# EAGLE design 18650_1S3P_Smart (EAGLE 9.6.2)
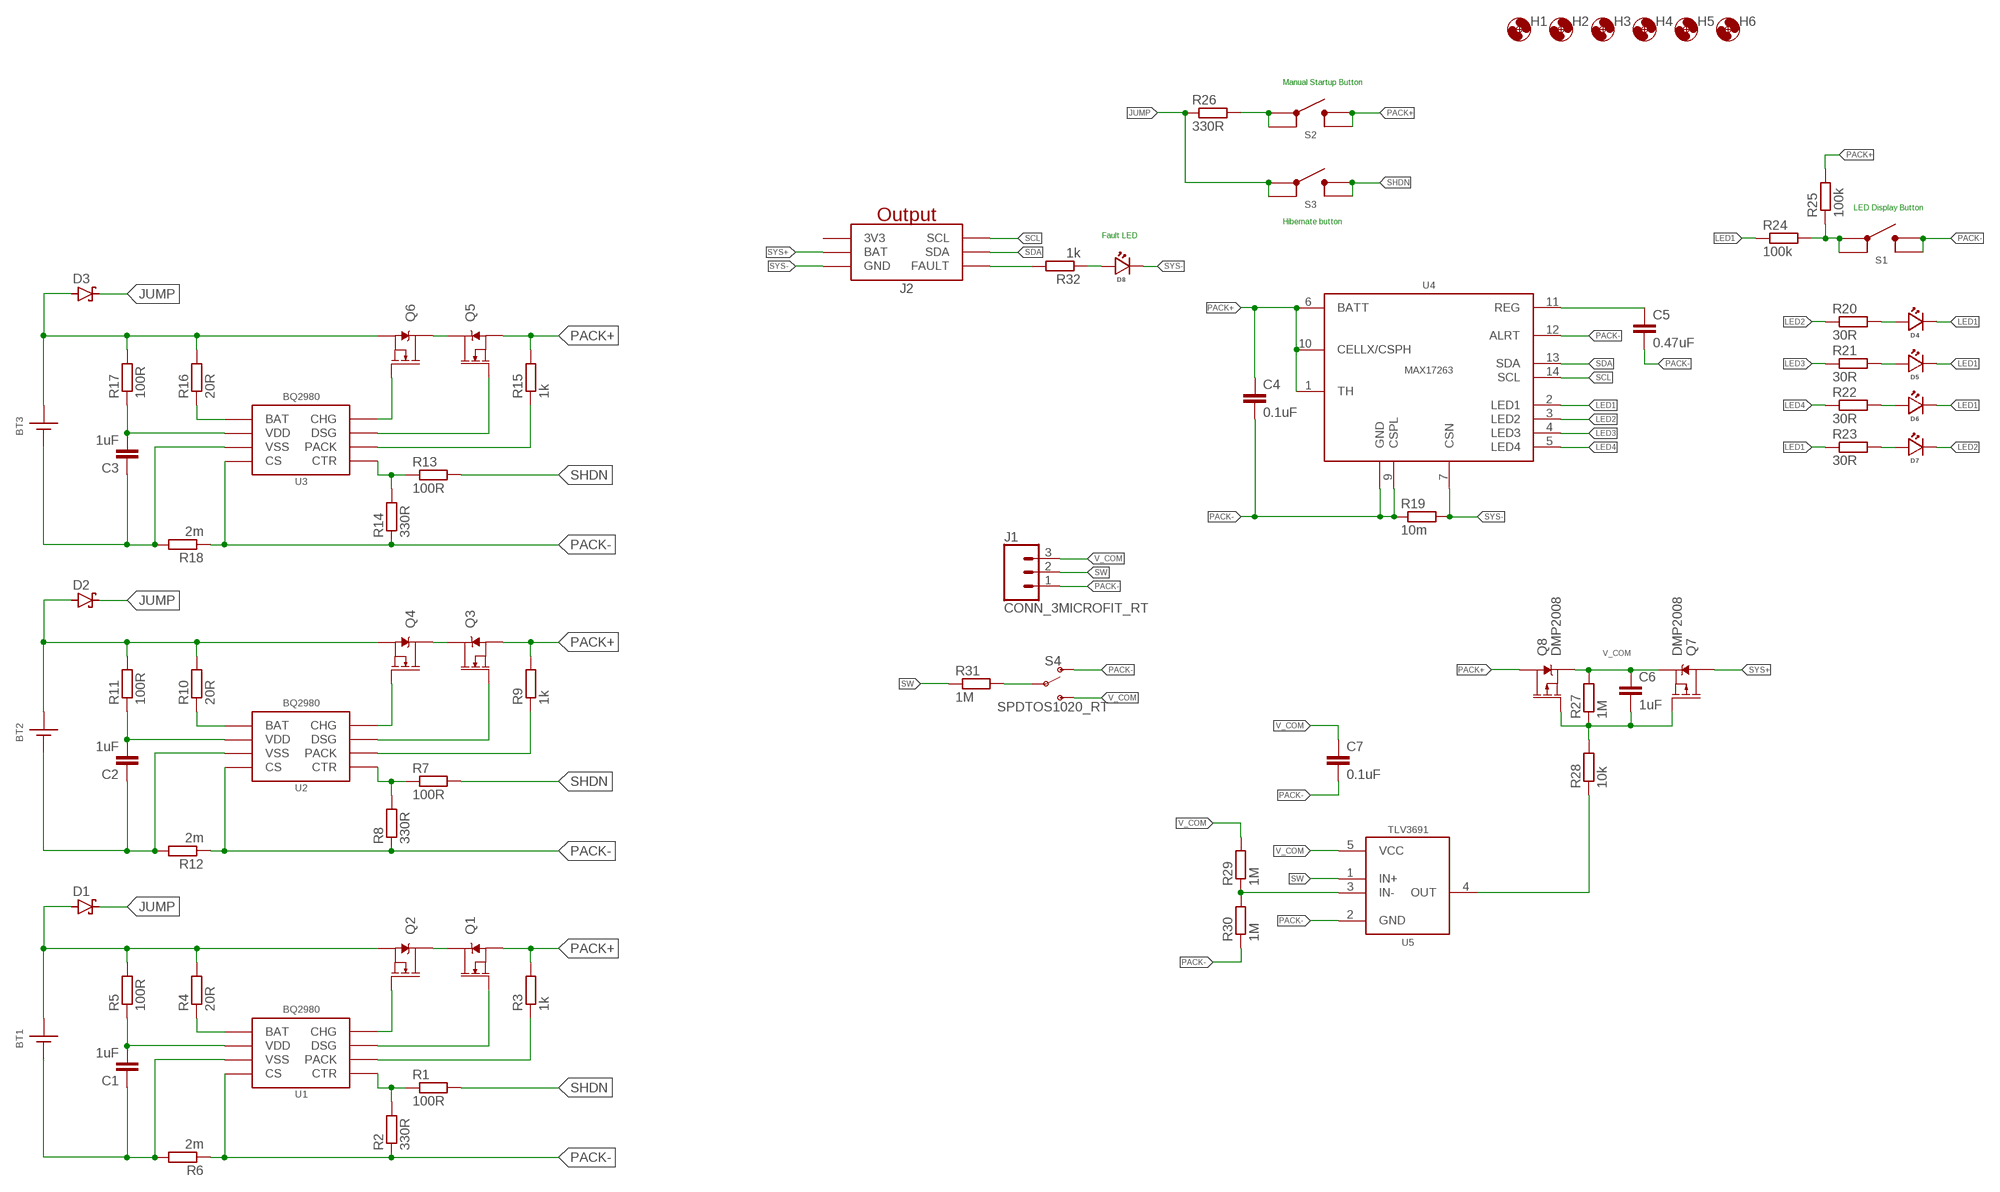
[diagram p0: schematic, sheet 1]

## Parts
BT1  186501042P_NOSILK  [BATT_1042P_NOSILK]
BT2  186501042P_NOSILK  [BATT_1042P_NOSILK]
BT3  186501042P_NOSILK  [BATT_1042P_NOSILK]
C1  1uF  C-EU1UFC0603  [C0603]
C2  1uF  C-EU1UFC0603  [C0603]
C3  1uF  C-EU1UFC0603  [C0603]
C4  0.1uF  C-EU0.1UFC0603  [C0603]
C5  0.47uF  C-EU0.47UFC0603  [C0603]
C6  1uF  C-EU1UFC0603  [C0603]
C7  0.1uF  C-EU0.1UFC0603  [C0603]
D1  DIODE_SCHOTTKYSOD-323  [SOD323-R]
D2  DIODE_SCHOTTKYSOD-323  [SOD323-R]
D3  DIODE_SCHOTTKYSOD-323  [SOD323-R]
D4  LED1206_BOTTOM  [LED_1206_BOTTOM]
D5  LED1206_BOTTOM  [LED_1206_BOTTOM]
D6  LED1206_BOTTOM  [LED_1206_BOTTOM]
D7  LED1206_BOTTOM  [LED_1206_BOTTOM]
D8  LED1206_BOTTOM  [LED_1206_BOTTOM]
H1  MOUNTING_HOLE4_NP  [4_40]
H2  MOUNTING_HOLE4_NP  [4_40]
H3  MOUNTING_HOLE4_NP  [4_40]
H4  MOUNTING_HOLE4_NP  [4_40]
H5  MOUNTING_HOLE4_NP  [4_40]
H6  MOUNTING_HOLE4_NP  [4_40]
J1  CONN_3MICROFIT_RT  [1X3_MICROFIT_RT]
J2  GEMS_POWER_PLUGOUTPUT  [2X3_MICROFIT_RT]
Q1  AON7522E  MOSFET-NCH-AON7522E  [DFN3X3A_8L_EP1_P]
Q2  AON7522E  MOSFET-NCH-AON7522E  [DFN3X3A_8L_EP1_P]
Q3  AON7522E  MOSFET-NCH-AON7522E  [DFN3X3A_8L_EP1_P]
Q4  AON7522E  MOSFET-NCH-AON7522E  [DFN3X3A_8L_EP1_P]
Q5  AON7522E  MOSFET-NCH-AON7522E  [DFN3X3A_8L_EP1_P]
Q6  AON7522E  MOSFET-NCH-AON7522E  [DFN3X3A_8L_EP1_P]
Q7  DMP2008  MOSFET-PCH-DMP2008  [POWERDI3333-8]
Q8  DMP2008  MOSFET-PCH-DMP2008  [POWERDI3333-8]
R1  100R  R-EU_100R0603  [R0603]
R2  330R  R-EU_330R0603  [R0603]
R3  1k  R-EU_1KR0603  [R0603]
R4  20R  R-EU_20R0603  [R0603]
R5  100R  R-EU_100R0603  [R0603]
R6  2m  R-EU_0.002R0805  [R0805]
R7  100R  R-EU_100R0603  [R0603]
R8  330R  R-EU_330R0603  [R0603]
R9  1k  R-EU_1KR0603  [R0603]
R10  20R  R-EU_20R0603  [R0603]
R11  100R  R-EU_100R0603  [R0603]
R12  2m  R-EU_0.002R0805  [R0805]
R13  100R  R-EU_100R0603  [R0603]
R14  330R  R-EU_330R0603  [R0603]
R15  1k  R-EU_1KR0603  [R0603]
R16  20R  R-EU_20R0603  [R0603]
R17  100R  R-EU_100R0603  [R0603]
R18  2m  R-EU_0.002R0805  [R0805]
R19  10m  R-EU_0.01R0805  [R0805]
R20  30R  R-EU_30R0603  [R0603]
R21  30R  R-EU_30R0603  [R0603]
R22  30R  R-EU_30R0603  [R0603]
R23  30R  R-EU_30R0603  [R0603]
R24  100k  R-EU_100KR0603  [R0603]
R25  100k  R-EU_100KR0603  [R0603]
R26  330R  R-EU_330R0603  [R0603]
R27  1M  R-EU_1MR0603  [R0603]
R28  10k  R-EU_10KR0603  [R0603]
R29  1M  R-EU_1MR0603  [R0603]
R30  1M  R-EU_1MR0603  [R0603]
R31  1M  R-EU_1MR0603  [R0603]
R32  1k  R-EU_1KR0603  [R0603]
S1  BUTTON6X6_TH  [SWITCH_6MM_TH]
S2  BUTTON6X6_TH  [SWITCH_6MM_TH]
S3  BUTTON6X6_TH  [SWITCH_6MM_TH]
S4  SPDTOS1020_RT  [OS102011MA1QN1]
U1  BQ2980RUG  [RUG_S-PQFP-N8]
U2  BQ2980RUG  [RUG_S-PQFP-N8]
U3  BQ2980RUG  [RUG_S-PQFP-N8]
U4  MAX17263  [DFN_14_3X3]
U5  TLV3691DCK  [DCK_R-PDSO-G5]

## Nets
JUMP: D1.C D2.C D3.C R26.1 S3.1 S3.2
LED1: D4.CATHODE D5.CATHODE D6.CATHODE R23.1 R24.1 U4.2(LED1)
LED2: D7.CATHODE R20.1 U4.3(LED2)
LED3: R21.1 U4.4(LED3)
LED4: R22.1 U4.5(LED4)
N$1: Q1.D Q2.D
N$2: Q2.G U1.8(CHG)
N$3: Q1.G U1.7(DSG)
N$4: R1.1 R2.2 U1.5(CTR)
N$5: R3.1 U1.6(PACK)
N$6: BT1.BATT+(+) D1.A Q2.S@1(S) Q2.S@2(S) Q2.S@3(S) R4.2 R5.2
N$7: C1.2 R5.1 U1.2(VDD)
N$8: R4.1 U1.1(BAT)
N$9: BT1.BATT-(-) C1.1 R6.2 U1.3(VSS)
N$10: Q3.D Q4.D
N$11: Q4.G U2.8(CHG)
N$12: Q3.G U2.7(DSG)
N$13: R9.1 U2.6(PACK)
N$14: R7.1 R8.2 U2.5(CTR)
N$15: BT2.BATT+(+) D2.A Q4.S@1(S) Q4.S@2(S) Q4.S@3(S) R10.2 R11.2
N$16: C2.2 R11.1 U2.2(VDD)
N$17: R10.1 U2.1(BAT)
N$18: BT2.BATT-(-) C2.1 R12.2 U2.3(VSS)
N$19: Q5.D Q6.D
N$20: Q6.G U3.8(CHG)
N$21: Q5.G U3.7(DSG)
N$22: R15.1 U3.6(PACK)
N$23: R13.1 R14.2 U3.5(CTR)
N$24: BT3.BATT+(+) D3.A Q6.S@1(S) Q6.S@2(S) Q6.S@3(S) R16.2 R17.2
N$25: C3.2 R17.1 U3.2(VDD)
N$26: R16.1 U3.1(BAT)
N$27: BT3.BATT-(-) C3.1 R18.2 U3.3(VSS)
N$28: D4.ANODE R20.2
N$29: D5.ANODE R21.2
N$30: D6.ANODE R22.2
N$31: D7.ANODE R23.2
N$32: R24.2 R25.1 S1.1 S1.2
N$33: C5.1 U4.11(REG)
N$34: R26.2 S2.1 S2.2
N$35: R31.2 S4.2(P)
N$36: C6.2 Q7.4(G) Q8.4(G) R27.1 R28.2
N$37: R28.1 U5.4(OUT)
N$38: J2.1(FAULT) R32.2
N$41: R29.1 R30.2 U5.3(IN-)
N$42: D8.ANODE R32.1
PACK+: C4.1 Q1.S@1(S) Q1.S@2(S) Q1.S@3(S) Q3.S@1(S) Q3.S@2(S) Q3.S@3(S) Q5.S@1(S) Q5.S@2(S) Q5.S@3(S) Q8.EP@1(D) Q8.EP@2(D) Q8.EP@3(D) Q8.EP@4(D) Q8.EP@5(D) R3.2 R9.2 R15.2 R25.2 S2.3 S2.4 U4.1(TH) U4.6(BATT) U4.10(CELLX/CSPH)
PACK-: C4.2 C5.2 C7.2 J1.1 R2.1 R6.1 R8.1 R12.1 R14.1 R18.1 R19.1 R30.1 S1.3 S1.4 S4.1(O) U1.4(CS) U2.4(CS) U3.4(CS) U4.8(GND) U4.9(CSPL) U4.12(ALRT) U4.EP(GND) U5.2(GND)
SCL: J2.4(SCL) U4.14(SCL)
SDA: J2.6(SDA) U4.13(SDA)
SHDN: R1.2 R7.2 R13.2 S3.3 S3.4
SW: J1.2 R31.1 U5.1(IN+)
SYS+: J2.3(BAT) Q7.EP@1(D) Q7.EP@2(D) Q7.EP@3(D) Q7.EP@4(D) Q7.EP@5(D)
SYS-: D8.CATHODE J2.2(GND) R19.2 U4.7(CSN)
V_COM: C6.1 C7.1 J1.3 Q7.1(S) Q7.2(S) Q7.3(S) Q8.1(S) Q8.2(S) Q8.3(S) R27.2 R29.2 S4.3(S) U5.5(VCC)

## Notes on the sheet
- Manual Startup Button
- LED Display Button
- Hibernate button
- Fault LED

## Power pins joined to a net without a drawn wire
3V3: J2.5(3V3)

## Library data of the parts
BT1-BT3 = bschulz:18650: Battery Holder 18650 form factor Variant for with or without circuit protection (length varries depending on this); DIGIKEY: 36-1042P-ND; MF: Keystone; MPN: 1042P
C1-C3 C6 = bschulz_passives:C-EU: CAPACITOR, European symbol; DIGIKEY: 587-1251-1-ND; MF: Yaiyo Yuden; MPN: EMK107BJ105KA-T
C4 C7 = bschulz_passives:C-EU: CAPACITOR, European symbol; DIGIKEY: 490-6051-1-ND; MF: Murata; MPN: GCM188R71E104KA57D
C5 = bschulz_passives:C-EU: CAPACITOR, European symbol; DIGIKEY: 1276-2083-1-ND; MF: Samsung; MPN: CL10B474KA8NNNC
D1-D3 = bschulz:DIODE_SCHOTTKY: Generic Shottky Diode; DIGIKEY: BAT54WS-FDICT-ND; MF: Diodes Inc; MPN: BAT54WS-7-F
D4-D7 = bschulz:LED: Genaric LED; DIGIKEY: 160-1456-1-ND; MF: Lite-On; MPN: LTST-C230KGKT
D8 = bschulz:LED: Genaric LED; DIGIKEY: 160-1457-1-ND; MF: Lite-On; MPN: LTST-C230KRKT
H1-H6 = bschulz:MOUNTING_HOLE: Genaric Mechanical Mounting Hole Hole diameter based on max body diameter + 15% Keepout ring is for diameter of socket cap screw (minimum required clearance) TPlace ring is for diameter of pan head screw (recomended clearance) Specifications: Socket Cap Button Head Socket Cap Pan Head; DIGIKEY: DNP; MF: N/A; MPN: DNP
J1 = bschulz:CONN_3: Genaric 3 terminal header Digikey 2.54_SCREW 3.5_SCREW; DIGIKEY: WM1861-ND; MF: Molex; MPN: 0436500300
J2 = bschulz:GEMS_POWER_PLUG: Power Plug For GEMS Based Systems Both Input and Output versions; DIGIKEY: WM1815-ND; DISP: Output; MF: Molex; MPN: 0430450600
Q1-Q6 = bschulz:MOSFET-NCH: N-channel MOSFET Small Signal/Low Power: BSS138 2N7002P 2N7002PW RE1C002UN; DIGIKEY: 785-1505-1-ND; MF: Alpha & Omega; MPN: AON7522E
Q7 Q8 = bschulz:MOSFET-PCH: P-channel MOSFET Small Signal/Low Power:; DIGIKEY: DMP2008UFG-7DICT-ND; MF: Diodes Inc; MPN: DMP2008UFG-7
R1 R5 R7 R11 R13 R17 = bschulz_passives:R-EU_: RESISTOR, European symbol Digikey Parts: Yageo, 0402 Yageo, 0603 Panasonic, 0603 Panasonic, precision, 0603 Panasonic, 0805 Rohm, current sense Vishay, pulse proof automotive; DIGIKEY: 311-100HRCT-ND; MF: Yageo; MPN: RC0603FR-07100RL; VALUE_PART: 100
R2 R8 R14 R26 = bschulz_passives:R-EU_: RESISTOR, European symbol Digikey Parts: Yageo, 0402 Yageo, 0603 Panasonic, 0603 Panasonic, precision, 0603 Panasonic, 0805 Rohm, current sense Vishay, pulse proof automotive; DIGIKEY: 311-330HRCT-ND; MF: Yageo; MPN: RC0603FR-07330RL; VALUE_PART: 330
R3 R9 R15 R32 = bschulz_passives:R-EU_: RESISTOR, European symbol Digikey Parts: Yageo, 0402 Yageo, 0603 Panasonic, 0603 Panasonic, precision, 0603 Panasonic, 0805 Rohm, current sense Vishay, pulse proof automotive; DIGIKEY: 311-1KLDCT-ND; MF: Yageo; MPN: AC0603FR-071KL; VALUE_PART: 1k
R4 R10 R16 = bschulz_passives:R-EU_: RESISTOR, European symbol Digikey Parts: Yageo, 0402 Yageo, 0603 Panasonic, 0603 Panasonic, precision, 0603 Panasonic, 0805 Rohm, current sense Vishay, pulse proof automotive; DIGIKEY: 311-20.0HRCT-ND; MF: Yageo; MPN: RC0603FR-0720RL; VALUE_PART: 20
R6 R12 R18 = bschulz_passives:R-EU_: RESISTOR, European symbol Digikey Parts: Yageo, 0402 Yageo, 0603 Panasonic, 0603 Panasonic, precision, 0603 Panasonic, 0805 Rohm, current sense Vishay, pulse proof automotive; DIGIKEY: RHM.002AJCT-ND; MF: Rohm; MPN: PMR10EZPFV2L00
R19 = bschulz_passives:R-EU_: RESISTOR, European symbol Digikey Parts: Yageo, 0402 Yageo, 0603 Panasonic, 0603 Panasonic, precision, 0603 Panasonic, 0805 Rohm, current sense Vishay, pulse proof automotive; DIGIKEY: CRF0805-FZ-R010ELFCT-ND; MF: Bourns; MPN: CRF0805-FZ-R010ELF
R20-R23 = bschulz_passives:R-EU_: RESISTOR, European symbol Digikey Parts: Yageo, 0402 Yageo, 0603 Panasonic, 0603 Panasonic, precision, 0603 Panasonic, 0805 Rohm, current sense Vishay, pulse proof automotive; DIGIKEY: 311-30.0HRCT-ND; MF: Yageo; MPN: RC0603FR-0730RL; VALUE_PART: 30
R24 R25 = bschulz_passives:R-EU_: RESISTOR, European symbol Digikey Parts: Yageo, 0402 Yageo, 0603 Panasonic, 0603 Panasonic, precision, 0603 Panasonic, 0805 Rohm, current sense Vishay, pulse proof automotive; DIGIKEY: 311-100KHRCT-ND; MF: Yageo; MPN: RC0603FR-07100KL; VALUE_PART: 100k
R27 R29-R31 = bschulz_passives:R-EU_: RESISTOR, European symbol Digikey Parts: Yageo, 0402 Yageo, 0603 Panasonic, 0603 Panasonic, precision, 0603 Panasonic, 0805 Rohm, current sense Vishay, pulse proof automotive; DIGIKEY: P1.00MHCT-ND; MF: Panasonic; MPN: ERJ-3EKF1004V; VALUE_PART: 1M
R28 = bschulz_passives:R-EU_: RESISTOR, European symbol Digikey Parts: Yageo, 0402 Yageo, 0603 Panasonic, 0603 Panasonic, precision, 0603 Panasonic, 0805 Rohm, current sense Vishay, pulse proof automotive; DIGIKEY: 311-10.0KHRCT-ND; MF: Yageo; MPN: RC0603FR-0710KL; VALUE_PART: 10k
S1-S3 = bschulz:BUTTON: Genaric SPST Push button; DIGIKEY: 450-1650-ND; MF: TE Connectivity; MPN: 1825910-6
S4 = bschulz:SPDT: Genaric SPDT switch; DIGIKEY: CKN9559-ND; MF: C&K; MPN: OS102011MA1QN1
U1-U3 = bschulz:BQ2980: BQ2980 - Voltage, Current, Temperature Protectors with an Integrated High-Side NFET (BMS) Characteristics: Vpack: < 20V Vdd: 1.5V ~ 5.5V Vbat: 1.5V ~ 5.5V IQ: 1μA Normal, 0.1μA Shutdown Operating Temperature: -40°C to 85°C Digikey: 296-47578-1-ND <https://www.digikey.com/product-detail/en/texas-instruments/BQ298000RUGT/296-47578-1-ND/8111032>; DIGIKEY: 296-47578-1-ND; MF: TI; MOUSER: 595-BQ298000RUGT; MPN: BQ298000RUGT
U4 = bschulz:MAX17263: MAX17263 - Single/Multi-Cell Fuel Gauge with Integrated LED Control Characteristics: Vin: 2.3 ~ 4.9V IQ: 15μA typ ILSB: 1.5625μV VLSB: 78.125μV Operating Temperature: -40°C to 85°C Digikey: 175-MAX17263LETD+TCT-ND <https://www.digikey.com/en/products/detail/maxim-integrated/MAX17263LETD-T/9833463>; DIGIKEY: 175-MAX17263LETD+TCT-ND; MF: Maxim; MPN: MAX17263LETD+T
U5 = bschulz:TLV3691: TLV3691 - Nanopower Analog Comparator Characteristics: Vin: 0.9V ~ 6.5V (± 0.45V ~ ± 3.25V) Response Time: 24us Push-Pull Output IQ: 75nA Operating Temperature: -40°C to 125°C Digikey: 296-37910-1-ND (DCK) <https://www.digikey.com/products/en/integrated-circuits-ics/linear-comparators/692?k=TLV3691&k=&pkeyword=TLV3691&sv=0&pv7=2&sf=0&FV=142c0371%2Cffe002b4&quantity=&ColumnSort=1000011&page=1&stock=1&pageSize=25> 296-37242-6-ND (DPF) <https://www.digikey.com/product-detail/en/texas-instruments/TLV3691IDPFR/296-37242-6-ND/4695352>; DIGIKEY: 296-37910-1-ND; MF: TI; MPN: TLV3691IDCKR

## Board
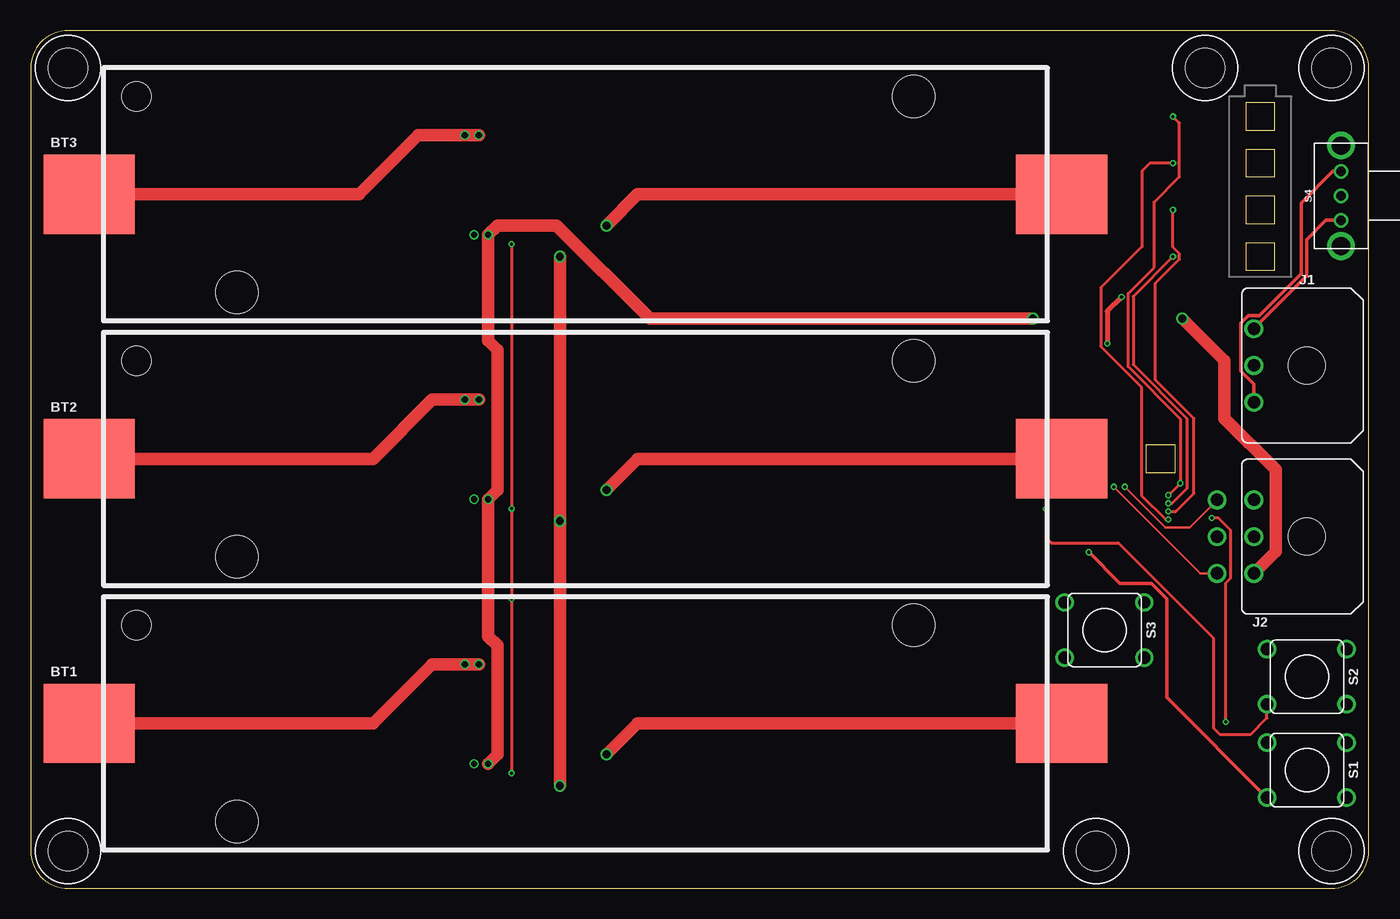
[diagram p1: board, top side]
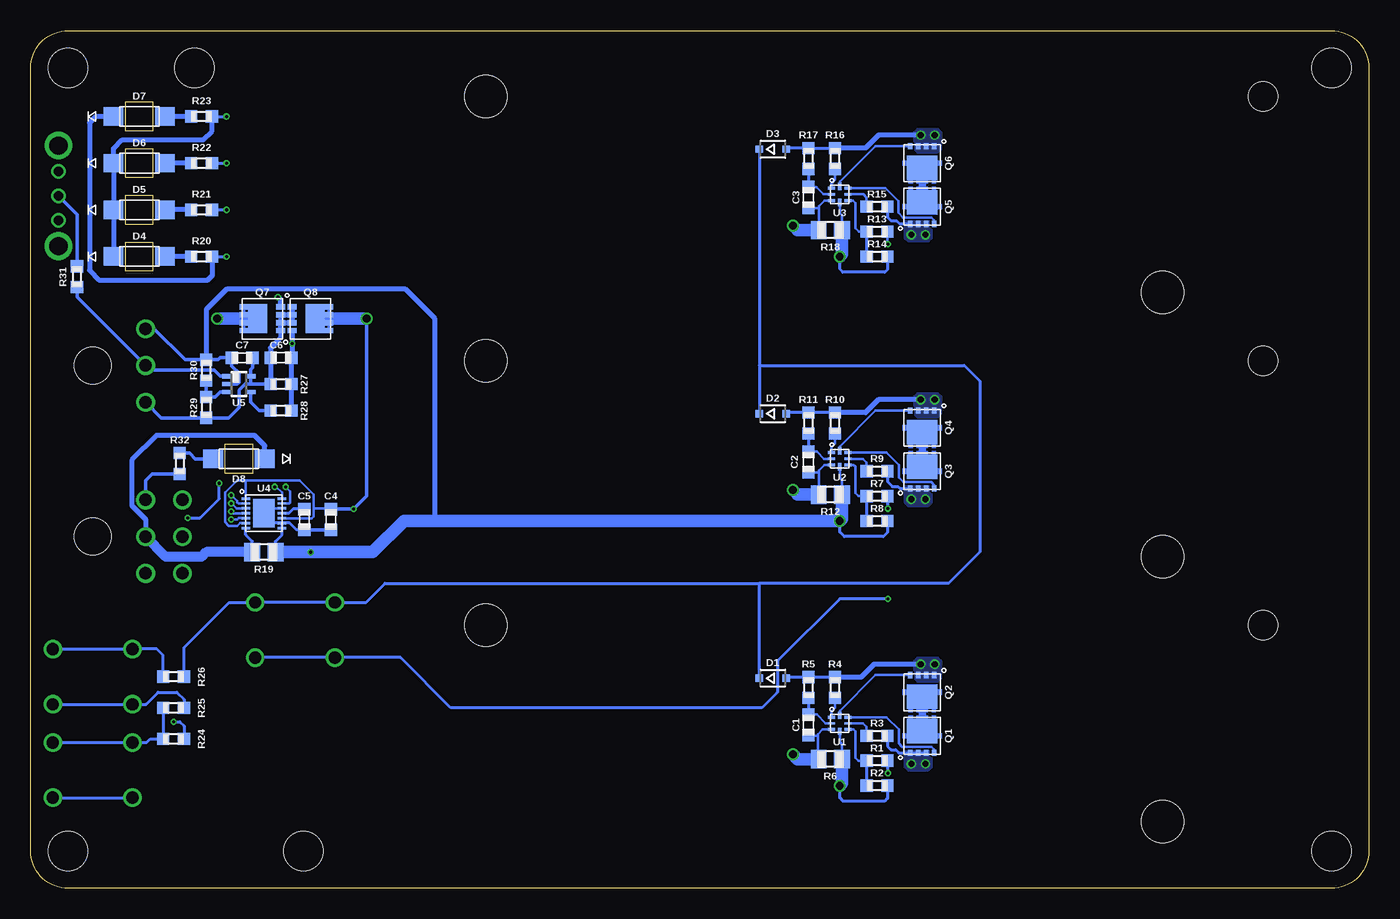
[diagram p2: board, bottom side, seen from below]

Size 109.2 x 70 mm. Coordinates in mm from the lower left corner, seen from the top.
Outline: 0,66.95 0,3.05 arc90 3.05,0 106.15,0 arc90 109.2,3.05 109.2,66.95 arc90 106.15,70 3.05,70 arc90 0,66.95
Copper layers (1*16): Top 0.035559375mm / dielectric 1.6mm / Bottom 0.035559375mm
Design rules "oshpark-2layer": minimum track width 6mil, minimum drill 10mil, track to track 6mil, track to pad 6mil, pad to pad 6mil, via to via 6mil, smd to smd 6mil, copper to edge 15mil, drill to drill 6mil, minimum pad ring 5mil, minimum via ring 5mil, stop-mask expansion 2.5mil, vias tented up to drill 0mil, thermal gap 10mil

### Footprints (pad centres in the part's own frame; a part is rotated, then mirrored left to right if it is on the bottom)
BATT_1042P_NOSILK = smd 7.46 x 6.47: BATT+ 39.67,0; BATT- -39.67,0 | hole 3.45: -27.6,-8; 27.6,8 | hole 2.39: 35.82,-8
C0603 = smd 1 x 1: 1 -0.85,0; 2 0.85,0
SOD323-R = smd 0.6 x 0.6: A 1.1,0; C -1.1,0
LED_1206_BOTTOM = smd 1.6 x 1.5: ANODE 2.1,0; CATHODE -2.1,0
4_40 = hole 3.175: 0,0
1X3_MICROFIT_RT = drill 1.02: 1 3,4.32; 2 0,4.32; 3 -3,4.32 | hole 3: 0,0
2X3_MICROFIT_RT = drill 1.02: 1 3,4.32; 2 0,4.32; 3 -3,4.32; 4 3,7.32; 5 0,7.32; 6 -3,7.32 | hole 3: 0,0
DFN3X3A_8L_EP1_P = smd 2.45 x 1.98: D 0,0.381 | smd 0.35 x 0.5: G 0.975,-1.4; S@1 -0.975,-1.4; S@2 -0.325,-1.4; S@3 0.325,-1.4
POWERDI3333-8 = smd 0.42 x 0.7: 1 -0.975,-1.5; 2 -0.325,-1.5; 3 0.325,-1.5; 4 0.975,-1.5; EP@1 0.975,1.5; EP@2 0.325,1.5; EP@3 -0.325,1.5; EP@4 -0.975,1.5 | smd 2.37 x 1.55: EP@5 0,0.381
R0603 = smd 1 x 1: 1 -0.85,0; 2 0.85,0
R0805 = smd 1.3 x 1.5: 1 -0.95,0; 2 0.95,0
SWITCH_6MM_TH = drill 1: 1 -3.25,2.25; 2 3.25,2.25; 3 -3.25,-2.25; 4 3.25,-2.25
OS102011MA1QN1 = drill 0.8: 1 -2,0; 2 0,0; 3 2,0 | drill 1.5: BODY@1 -4.1,0; BODY@2 4.1,0
RUG_S-PQFP-N8 = smd 0.55 x 0.25: 1 -0.675,0.5; 3 -0.675,-0.5; 5 0.675,-0.5; 7 0.675,0.5 | smd 0.55 x 0.2: 2 -0.675,0; 6 0.675,0 | smd 0.3 x 0.6: 4 0,-0.65; 8 0,0.65
DFN_14_3X3 = smd 0.7 x 0.2: 1 -1.475,1.2; 2 -1.475,0.8; 3 -1.475,0.4; 4 -1.475,0; 5 -1.475,-0.4; 6 -1.475,-0.8; 7 -1.475,-1.2; 8 1.475,-1.2; 9 1.475,-0.8; 10 1.475,-0.4; 11 1.475,0; 12 1.475,0.4; 13 1.475,0.8; 14 1.475,1.2 | smd 1.78 x 2.35: EP 0,0
DCK_R-PDSO-G5 = smd 0.35 x 0.8: 1 -0.65,-0.95; 2 0,-0.95; 3 0.65,-0.95; 4 0.65,0.95; 5 -0.65,0.95

### Placement (x,y rotation side)
BT1  44.45,13.46 180 top
BT2  44.45,35.05 180 top
BT3  44.45,56.64 180 top
C1  45.72,13.34 90 bottom
C2  45.72,34.8 90 bottom
C3  45.72,56.39 90 bottom
C4  84.71,30.1 270 bottom
C5  86.87,30.1 270 bottom
C6  88.77,43.31 0 bottom
C7  91.95,43.31 180 bottom
D1  48.64,17.14 0 bottom
D2  48.64,38.73 0 bottom
D3  48.64,60.33 0 bottom
D4  100.33,51.56 0 bottom
D5  100.33,55.37 0 bottom
D6  100.33,59.18 0 bottom
D7  100.33,62.99 0 bottom
D8  92.2,35.05 180 bottom
H1  3.05,66.95 0 top
H2  3.05,3.05 0 top
H3  106.15,3.05 0 top
H4  106.15,66.95 0 top
H5  95.84,66.95 0 top
H6  86.95,3.05 0 top
J1  104.14,42.67 90 top
J2  104.14,28.7 90 top
Q1  36.45,12.45 0 bottom
Q2  36.45,16 180 bottom
Q3  36.45,34.04 0 bottom
Q4  36.45,37.59 180 bottom
Q5  36.45,55.63 0 bottom
Q6  36.45,59.18 180 bottom
Q7  90.3,46.48 90 bottom
Q8  86.36,46.48 270 bottom
R1  40.13,10.41 0 bottom
R2  40.13,8.38 180 bottom
R3  40.13,12.45 0 bottom
R4  43.56,16.38 90 bottom
R5  45.72,16.38 90 bottom
R6  43.94,10.54 180 bottom
R7  40.13,32 0 bottom
R8  40.13,29.97 180 bottom
R9  40.13,34.04 0 bottom
R10  43.56,37.97 90 bottom
R11  45.72,37.97 90 bottom
R12  43.94,32.13 180 bottom
R13  40.13,53.59 0 bottom
R14  40.13,51.56 180 bottom
R15  40.13,55.63 0 bottom
R16  43.56,59.56 90 bottom
R17  45.72,59.56 90 bottom
R18  43.94,53.72 180 bottom
R19  90.17,27.43 180 bottom
R20  95.25,51.56 180 bottom
R21  95.25,55.37 180 bottom
R22  95.25,59.18 180 bottom
R23  95.25,62.99 180 bottom
R24  97.54,12.19 180 bottom
R25  97.54,14.73 0 bottom
R26  97.54,17.27 180 bottom
R27  88.77,41.15 180 bottom
R28  88.77,38.99 0 bottom
R29  94.87,39.24 270 bottom
R30  94.87,42.29 270 bottom
R31  105.41,49.91 90 bottom
R32  97.03,34.67 270 bottom
S1  104.14,9.65 0 top
S2  104.14,17.27 0 top
S3  87.63,21.08 0 top
S4  106.93,56.52 90 top
U1  43.18,13.46 0 bottom
U2  43.18,35.05 0 bottom
U3  43.18,56.64 0 bottom
U4  90.17,30.61 0 bottom
U5  92.2,41.15 270 bottom

### Tracks (layer width: path | path; a pad name or v marks a point on that pad's centre or on a via)
JUMP
  Bottom 0.254: D1.C 49.74,24.89 | 49.74,24.89 80.28,24.89 81.84,23.33 S3.1 S3.2 93,23.33 96.69,19.65 R26.1 | D3.C 49.74,42.67 | 49.74,42.67 D2.C | 49.74,42.67 33.02,42.67 31.75,41.4 31.75,27.43 34.29,24.89 49.74,24.89
LED1  (via drill 0.25)
  Top 0.254: v92.84,32.08 v93.81,33.06 93.81,38.31 89.56,42.57 89.56,48.54 91.69,50.67 91.69,56.01 93.75,58.06 93.75,62.46 v93.22,62.99 | v97.54,13.59 97.54,24.94 97.92,25.32 97.92,29.21 96.9,30.23 v96.39,30.23
  Bottom 0.2: U4.2 92.24,31.41 92.33,31.5 92.33,31.63 92.78,32.08 v92.84,32.08
  Bottom 0.254: R23.1 v93.22,62.99 | v97.54,13.59 97.03,13.59 96.69,13.25 R24.1 | v96.39,30.23 95.38,30.23 93.81,31.79 v93.81,33.06
  Bottom 0.406: D4.CATHODE D5.CATHODE D6.CATHODE 102.43,60.38 101.73,61.09 95.12,61.09 94.4,61.81 R23.1
LED2  (via drill 0.25)
  Top 0.254: v92.84,31.42 93.14,31.42 94.39,32.66 94.39,38.32 89.97,42.74 89.97,48.31 v93.22,51.56
  Bottom 0.2: U4.3 92.37,31.01 92.78,31.42 v92.84,31.42
  Bottom 0.254: R20.1 v93.22,51.56
  Bottom 0.406: D7.CATHODE 103.89,62.99 104.39,62.48 104.39,50.42 103.63,49.66 94.74,49.66 94.36,50.04 94.36,51.52 R20.1
LED3  (via drill 0.25)
  Top 0.254: v92.84,30.76 93.44,30.76 94.92,32.24 94.92,38.36 91.79,41.49 91.79,49.38 93.75,51.34 93.75,51.78 93.22,52.32 v93.22,55.37
  Bottom 0.2: v92.84,30.76 92.69,30.61 U4.4
  Bottom 0.254: R21.1 v93.22,55.37
LED4  (via drill 0.25)
  Top 0.254: v93.22,59.18 91.31,59.18 90.68,58.55 90.68,52.37 87.33,49.02 87.33,44.23 90.65,40.9 90.65,32.06 92.62,30.1 v92.84,30.1
  Bottom 0.2: U4.5 92.22,30.21 92.33,30.1 v92.84,30.1
  Bottom 0.254: R22.1 v93.22,59.18
N$1
  Bottom 0.61: Q2.D Q1.D
N$2
  Bottom 0.2: U1.8 43.18,14.48 40.26,17.4 Q2.G
N$3
  Bottom 0.2: U1.7 39.36,13.96 38.35,12.95 38.35,11.81 38.1,11.56 35.69,11.56 35.47,11.34 Q1.G
N$4
  Bottom 0.2: U1.5 42.05,12.96 41.91,12.83 41.91,10.67 41.66,10.41 R1.1
  Bottom 0.254: R1.1 R2.2
N$5
  Bottom 0.2: U1.6 41.27,13.46 40.98,13.17 R3.1
N$6  (via drill 0.5)
  Top 1.016: BT1.BATT+ 27.94,13.46 32.77,18.29 v36.58,18.29
  Bottom 0.254: R4.2 R5.2 47.45,17.23 D1.A
  Bottom 0.406: R4.2 41.44,17.23 40.39,18.29 v36.58,18.29
  other vias: 35.43,18.29
  pour Bottom (no thermals): 37.08,18.54 37.08,17.14 36.83,16.89 35.18,16.89 34.92,17.14 34.92,18.54 35.18,18.8 36.83,18.8
N$7
  Bottom 0.2: C1.2 45.05,14.19 44.32,13.46 U1.2
  Bottom 0.254: R5.1 C1.2
N$8
  Bottom 0.2: U1.1 43.85,14.44 43.56,14.73 R4.1
N$9  (via drill 0.65)
  Top 1.016: BT1.BATT- 49.53,13.46 v46.99,10.92
  Bottom 0.2: U1.3 44.57,12.96 44.96,12.57 44.96,12.45 | 44.96,12.45 44.96,10.61 R6.2 | C1.1 45.68,12.45 44.96,12.45
  Bottom 1.016: R6.2 46.61,10.54 v46.99,10.92
N$10
  Bottom 0.61: Q4.D Q3.D
N$11
  Bottom 0.2: U2.8 43.18,36.07 40.26,38.99 Q4.G
N$12
  Bottom 0.2: U2.7 39.36,35.55 38.35,34.54 38.35,33.53 37.97,33.15 35.69,33.15 35.47,32.93 Q3.G
N$13
  Bottom 0.2: U2.6 41.27,35.05 40.98,34.76 R9.1
N$14
  Bottom 0.2: U2.5 42.05,34.55 41.91,34.42 41.91,32.26 41.66,32 R7.1
  Bottom 0.254: R7.1 R8.2
N$15  (via drill 0.5)
  Top 1.016: BT2.BATT+ 27.94,35.05 32.77,39.88 v36.58,39.88
  Bottom 0.254: R10.2 R11.2 47.45,38.82 D2.A
  Bottom 0.406: v36.58,39.88 40.01,39.88 41.07,38.82 R10.2
  other vias: 35.43,39.88
  pour Bottom (no thermals): 37.08,40.13 37.08,38.73 36.83,38.48 35.18,38.48 34.92,38.73 34.92,40.13 35.18,40.39 36.83,40.39
N$16
  Bottom 0.2: U2.2 44.45,35.05 45.05,35.65 C2.2
  Bottom 0.254: R11.1 C2.2
N$17
  Bottom 0.2: R10.1 43.56,36.32 43.85,36.03 U2.1
N$18  (via drill 0.65)
  Top 1.016: BT2.BATT- 49.53,35.05 v46.99,32.51
  Bottom 0.2: U2.3 44.44,34.55 44.89,34.1 44.89,33.95 | 44.89,33.95 R12.2 | C2.1 44.89,33.95
  Bottom 1.016: R12.2 46.61,32.13 v46.99,32.51
N$19
  Bottom 0.61: Q6.D Q5.D
N$20
  Bottom 0.2: U3.8 43.18,57.66 40.26,60.58 Q6.G
N$21
  Bottom 0.2: Q5.G 35.47,54.53 35.69,54.74 38.01,54.74 38.4,55.13 38.4,56.1 39.44,57.14 U3.7
N$22
  Bottom 0.2: R15.1 40.98,56.39 41.24,56.64 U3.6
N$23
  Bottom 0.2: U3.5 42.5,56.13 42.12,56.13 41.91,55.93 41.91,53.89 41.62,53.59 R13.1
  Bottom 0.254: R13.1 R14.2
N$24  (via drill 0.5)
  Top 1.016: BT3.BATT+ 26.8,56.64 31.62,61.47 v36.58,61.47
  Bottom 0.254: R16.2 R17.2 47.45,60.41 D3.A
  Bottom 0.406: v36.58,61.47 40.01,61.47 41.07,60.41 R16.2
  other vias: 35.43,61.47
  pour Bottom (no thermals): 37.08,61.72 37.08,60.33 36.83,60.07 35.18,60.07 34.92,60.33 34.92,61.72 35.18,61.98 36.83,61.98
N$25
  Bottom 0.2: C3.2 45.09,57.24 44.49,56.64 U3.2
  Bottom 0.254: R17.1 C3.2
N$26
  Bottom 0.2: R16.1 43.56,57.82 43.85,57.53 U3.1
N$27  (via drill 0.65)
  Top 1.016: BT3.BATT- 49.53,56.64 v46.99,54.1
  Bottom 0.2: R18.2 44.89,55.5 | 44.89,55.5 44.89,55.69 44.44,56.14 U3.3 | C3.1 45.68,55.5 44.89,55.5
  Bottom 1.016: v46.99,54.1 46.61,53.72 R18.2
N$28
  Bottom 0.406: R20.2 D4.ANODE
N$29
  Bottom 0.406: R21.2 D5.ANODE
N$30
  Bottom 0.406: R22.2 D6.ANODE
N$31
  Bottom 0.406: R23.2 D7.ANODE
N$32
  Bottom 0.254: R25.1 R24.2 99.44,12.19 99.73,11.9 S1.1 S1.2
N$33
  Bottom 0.254: C5.1 87.8,30.95 88.14,30.61 U4.11
N$34
  Bottom 0.254: S2.2 S2.1 98.9,19.52 98.39,19.01 R26.2
N$35
  Bottom 0.305: R31.2 105.41,54.99 S4.2
N$36  (via drill 0.25)
  Top 0.406: v89.03,48.26 87.86,47.09 v87.86,44.45
  Bottom 0.406: R28.2 R27.1 C6.2 87.86,43.37 v87.86,44.45 Q8.4 | Q7.4 88.8,48.03 v89.03,48.26
N$37
  Bottom 0.305: U5.4 91.25,39.69 90.55,38.99 R28.1
N$38
  Bottom 0.305: R32.2 99.28,33.82 99.82,33.28 J2.1
N$41
  Bottom 0.305: R30.2 R29.1 94.15,40.09 93.74,40.5 U5.3
N$42
  Bottom 0.305: R32.1 96.23,35.52 95.76,35.05 D8.ANODE
PACK+  (via drill 0.25, 0.5, 0.65)
  Top 0.254: v82.84,30.95 82.84,28.66 83.31,28.19 88.75,28.19 96.52,20.42 96.52,13.08 97.03,12.57 99.57,12.57 100.89,13.89 S2.3
  Top 1.016: v37.34,10.16 38.1,10.92 38.1,19.81 37.34,20.57 v37.34,31.75 38.1,32.51 38.1,43.94 37.34,44.7 v37.34,53.34 38.1,54.1 42.93,54.1 50.55,46.48 v81.79,46.48
  Bottom 0.2: U4.6 92.11,29.81 92.33,29.59 93.05,29.59 93.34,29.89 93.34,32.29 92.36,33.27 91.64,33.27 | 91.64,33.27 87.25,33.27 86.11,32.13 86.11,30.99 | 86.11,30.99 86.11,30.35 86.27,30.19 88.67,30.19 U4.10 | U4.1 91.64,33.27 | C4.1 84.75,30.99 86.11,30.99
  Bottom 0.254: R15.2 39.28,54.78 38.99,54.48 38.54,54.48 38.3,54.24 37.44,54.24 Q5.S@1 | R9.2 39.28,33.19 38.88,32.78 38.41,32.78 38.27,32.64 Q3.S@1 | R3.2 39.28,11.6 38.99,11.3 38.61,11.3 38.35,11.05 Q1.S@1 Q1.S@2 Q1.S@3 | S2.4 S2.3 99.79,15.02 98.81,16 97.28,16 96.69,15.41 R25.2
  Bottom 0.305: Q8.EP@3 Q8.EP@2 Q8.EP@1 | Q8.EP@3 Q8.EP@4 | Q8.EP@3 85.19,46.48 Q8.EP@5 | v81.79,46.48 81.79,32 v82.84,30.95 C4.1
  Bottom 1.016: v81.79,46.48 Q8.EP@5
  other vias: 36.2,53.34 36.2,31.75 36.2,10.16
  pour Bottom (no thermals): 37.59,54.74 37.85,54.48 37.85,53.09 37.59,52.83 35.94,52.83 35.69,53.09 35.69,54.48 35.94,54.74
  pour Bottom (no thermals): 37.85,33.02 37.85,31.5 37.59,31.24 35.94,31.24 35.69,31.5 35.69,33.15 35.81,33.27 37.59,33.27
  pour Bottom (no thermals): 37.85,11.56 37.85,9.91 37.59,9.65 35.94,9.65 35.69,9.91 35.69,11.56 35.81,11.68 37.72,11.68
PACK-  (via drill 0.25, 0.65)
  Top 0.305: S1.3 92.71,15.58 92.71,23.62 91.44,24.89 88.9,24.89 v86.36,27.43 | J1.1 104.14,49.99 104.14,52.96 105.7,54.52 S4.1
  Top 1.016: v43.18,51.56 v43.18,29.97 v43.18,8.38
  Bottom 0.2: R18.1 42.99,54.93 43.18,55.12 U3.4 | U2.4 43.18,33.53 42.99,33.34 R12.1 | U1.4 43.18,11.94 42.99,11.75 R6.1 | U4.12 89.77,31.01 U4.EP
  Bottom 0.254: S1.4 S1.3 | R2.1 39.28,7.33 39.5,7.11 42.93,7.11 43.18,7.37 v43.18,8.38 | R8.1 39.28,29.04 39.62,28.7 42.8,28.7 43.18,29.08 v43.18,29.97 | R14.1 39.28,50.51 39.5,50.29 42.93,50.29 43.18,50.55 v43.18,51.56 | R19.1 89.22,28.32 88.69,28.85 U4.8 U4.9 | 89.94,30.61 U4.EP 90.17,29.84 90.13,29.81 U4.9 | C5.2 87.5,29.25 88.06,29.81 U4.9
  Bottom 0.305: J1.1 99.14,45.67 96.61,43.14 R30.1 93.89,43.14 93.73,43.31 C7.2 92.8,42.63 92.2,42.04 92.2,41.27 92.33,41.15 U5.2 | C4.2 C5.2
  Bottom 0.406: 76.2,29.97 76.2,46.48 78.61,48.9 93.22,48.9 94.87,47.24 R30.1
  Bottom 1.016: R18.1 42.99,51.75 v43.18,51.56 | v43.18,8.38 42.99,8.57 R6.1 | R12.1 42.99,30.16 v43.18,29.97 76.2,29.97 78.74,29.97 81.28,27.43 v86.36,27.43 R19.1
SCL  (via drill 0.25)
  Top 0.2: J2.4 94.58,29.46 92.58,29.46 v89.28,32.77
  Bottom 0.2: v89.28,32.77 89.15,32.77 88.69,32.31 U4.14
SDA  (via drill 0.25)
  Top 0.2: J2.6 95.46,25.7 v88.39,32.77
  Bottom 0.2: U4.13 88.1,31.41 88.01,31.5 88.01,32.38 v88.39,32.77
SHDN  (via drill 0.25)
  Top 0.254: v39.24,52.58 v39.24,30.99 v39.24,23.62 v39.24,9.4
  Bottom 0.2: R13.2 39.28,52.62 v39.24,52.58
  Bottom 0.254: R7.2 39.28,31.03 v39.24,30.99 | R1.2 39.28,9.44 v39.24,9.4 | S3.4 S3.3 79.03,18.83 74.93,14.73 49.53,14.73 48.26,16 48.26,18.54 43.18,23.62 v39.24,23.62
SW
  Bottom 0.305: U5.1 93.74,41.8 94.23,42.29 99.44,42.29 J1.2 105.41,48.26 R31.1
SYS+  (via drill 0.65)
  Top 1.016: J2.3 101.6,27.48 101.6,34.16 97.41,38.35 97.41,43.05 v93.98,46.48
  Bottom 0.305: Q7.EP@4 Q7.EP@3 Q7.EP@2 | Q7.EP@2 Q7.EP@1 | Q7.EP@2 91.47,46.48 Q7.EP@5
  Bottom 1.016: Q7.EP@5 v93.98,46.48
SYS-
  Bottom 0.254: R19.2 91.12,28.32 91.64,28.85 U4.7
  Bottom 0.406: D8.CATHODE 90.1,36.13 90.93,36.96 98.93,36.96 100.94,34.95 100.94,31.24 99.82,30.12 J2.2
  Bottom 0.813: R19.2 94.87,27.43 95.25,27.05 98.17,27.05 J2.2
V_COM
  Top 0.305: J1.3 99.82,41.16 98.75,42.23 98.75,46.12 99.38,46.74 100.24,46.74 103.68,50.18 103.68,55.93 106.27,58.52 S4.3
  Bottom 0.305: C7.1 91.1,42.51 91.25,42.35 U5.5 91.25,41.21 91.31,41.15 | 91.31,41.15 91.68,41.15 92.14,40.69 92.15,40.69 92.2,40.64 92.2,39.24 93.05,38.39 R29.2 98.54,38.39 J1.3 | 91.31,41.15 R27.2
  Bottom 0.406: R27.2 C6.1 89.62,44.11 88.8,44.93 Q7.1 Q7.2 | Q7.2 Q7.3 Q8.2 | Q7.2 Q8.3 Q8.2 | Q8.1 Q8.2

### Text on the board
tDocu: OFF | CHARGE STAT | + | - | ON | EXT / SWITCH | FAULT | + | - | POWER OUT | SLEEP | JUMP | INFO | + | - | 1S3P - Smart - 18650 / Project Gonk / Bobby Schulz / v1.2
bDocu: SN | INFO - Press to display battery charge state via CHARGE STAT LEDs / JUMP - Press to "jump start" system on first insertion of batteries. / System will start automatically if charger is applied / SLEEP - Press and hold for > 6s in order to place the device in shutdown for shipping or storage. / Must press JUMP or connect charger to start again